# Altium schematic sheet Distance and PhotoElectric.SchDoc
size A; SheetNumber: 5; SheetTotal: 7
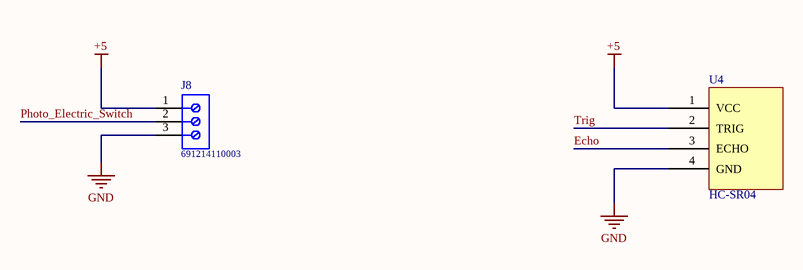
[diagram p0: Distance and PhotoElectric.SchDoc]

## Parts
J8  691214110003  [691214110003]
U4  HC-SR04  [HC-SR04]

## Nets
+5: J8.1 U4.1(VCC)
GND: J8.3 U4.4(GND)
Echo: U4.3(ECHO)
Photo_Electric_Switch: J8.2
Trig: U4.2(TRIG)

## Library data of the parts
J8 = CMP-1502-02466-1: Serie 2141 - 3.50 mm Horizontal Entry Modular with Rising Cage Clamp WR-TBL, 3 pin; Manufacturer: Wurth Elektronik; Pin Number: 3; Pitch: 3.50mm; Package Reference: 691214110003; Mounting Technology: THT; Part Number: 691214110003; Manufacturer URL: http://www.we-online.de; Packaging: Box; Operating Temperature: -40to105degC; Publisher: WurthElektronik; Datasheet URL: http://katalog.we-online.de/em/datasheet/6912141100xx.pdf
U4 = HC - SR04: 5V 15mA Distance Sensor THT Arduino Sensor